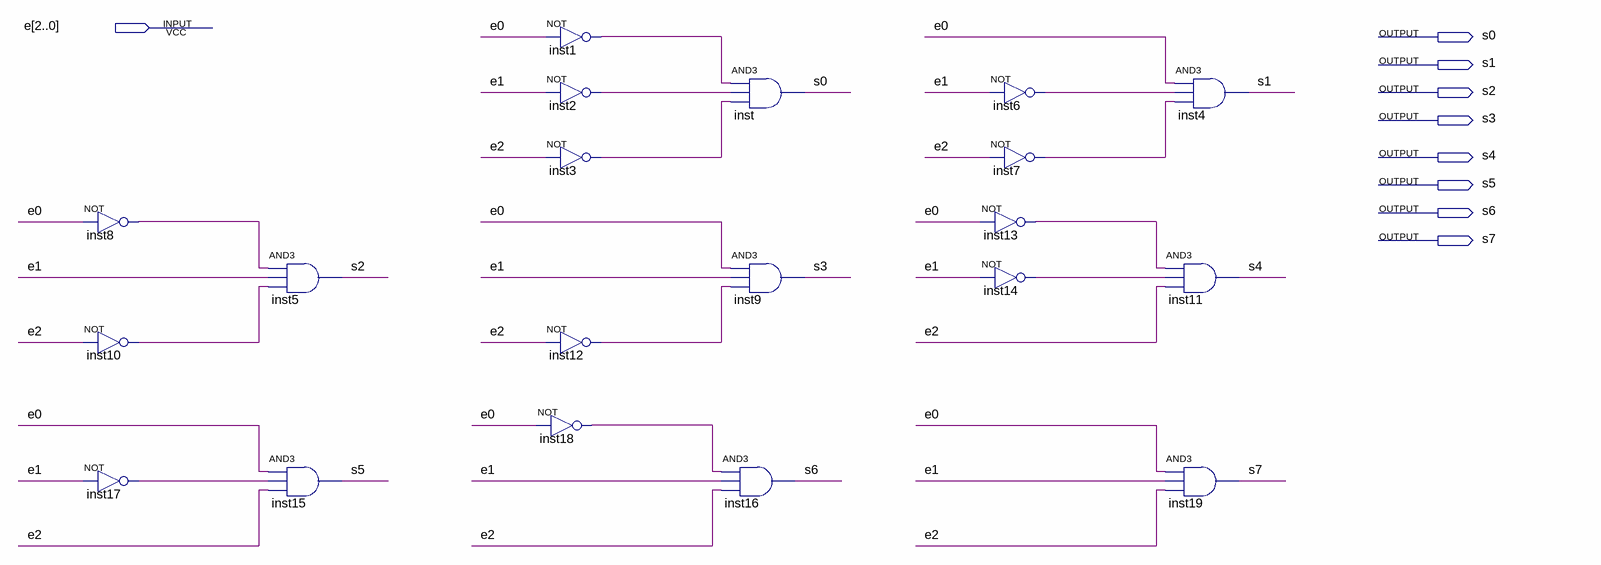
[diagram p0: schematic sheet]
// Quartus schematic mbr_decod3x8.bdf as structural Verilog: 20 symbols, 9 pins
module mbr_decod3x8 (
  input  [2:0] e,
  output s0,
  output s1,
  output s2,
  output s3,
  output s4,
  output s5,
  output s6,
  output s7
);

  wire inst1_out, inst2_out, inst3_out, inst6_out, inst7_out, inst8_out, inst10_out, inst12_out, inst13_out,
       inst14_out, inst17_out, inst18_out;

  not inst8 (inst8_out, e[0]);
  not inst10 (inst10_out, e[2]);
  not inst17 (inst17_out, e[1]);
  and inst5 (s2, inst8_out, e[1], inst10_out);
  and inst15 (s5, e[0], inst17_out, e[2]);
  not inst1 (inst1_out, e[0]);
  not inst2 (inst2_out, e[1]);
  not inst3 (inst3_out, e[2]);
  not inst12 (inst12_out, e[2]);
  not inst18 (inst18_out, e[0]);
  and inst (s0, inst1_out, inst2_out, inst3_out);
  and inst9 (s3, e[0], e[1], inst12_out);
  and inst16 (s6, inst18_out, e[1], e[2]);
  not inst6 (inst6_out, e[1]);
  not inst7 (inst7_out, e[2]);
  not inst13 (inst13_out, e[0]);
  not inst14 (inst14_out, e[1]);
  and inst4 (s1, e[0], inst6_out, inst7_out);
  and inst11 (s4, inst13_out, inst14_out, e[2]);
  and inst19 (s7, e[0], e[1], e[2]);
endmodule
